# EAGLE design InputBoard (EAGLE 9.4.0)
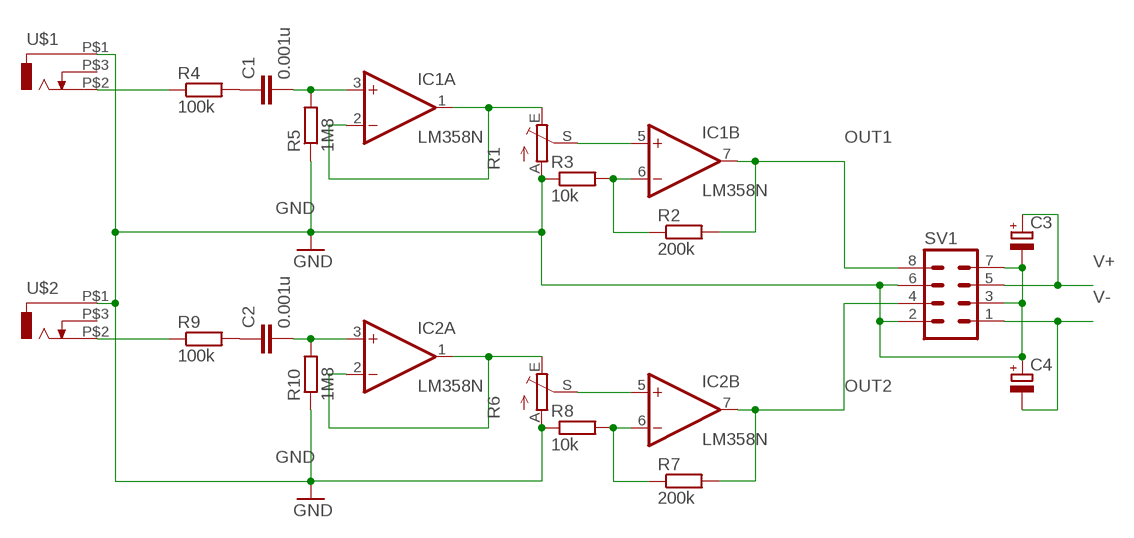
[diagram p0: schematic, sheet 1]

## Parts
C1  0.001u  C-EU050-025X075  [C050-025X075]
C2  0.001u  C-EU050-025X075  [C050-025X075]
C3  CPOL-EUE5-8.5  [E5-8,5]
C4  CPOL-EUE5-8.5  [E5-8,5]
IC1  LM358N  [DIL08]
IC2  LM358N  [DIL08]
R1  TRIM_EU-CIP20C-6MM  [CIP20C-6MM]
R2  200k  R-EU_0207/10  [0207/10]
R3  10k  R-EU_0207/10  [0207/10]
R4  100k  R-EU_0207/10  [0207/10]
R5  1M8  R-EU_0207/10  [0207/10]
R6  TRIM_EU-CIP20C-6MM  [CIP20C-6MM]
R7  200k  R-EU_0207/10  [0207/10]
R8  10k  R-EU_0207/10  [0207/10]
R9  100k  R-EU_0207/10  [0207/10]
R10  1M8  R-EU_0207/10  [0207/10]
SV1  MA04-2  [MA04-2]
U$1  EBS63P  [EBS63P]
U$2  EBS63P  [EBS63P]

## Nets
GND: C3.- C4.+ R1.A R3.1 R5.1 R6.A R8.1 R10.1 SV1.2 SV1.3 SV1.6 SV1.7 U$1.P$1 U$2.P$1
N$1: IC1.1(A:OUT) IC1.2(A:-IN) R1.E
N$2: IC1.5(B:+IN) R1.S
N$3: IC1.6(B:-IN) R2.1 R3.2
N$4: C1.2 IC1.3(A:+IN) R5.2
N$5: C1.1 R4.2
N$6: IC2.1(A:OUT) IC2.2(A:-IN) R6.E
N$7: IC2.5(B:+IN) R6.S
N$8: IC2.6(B:-IN) R7.1 R8.2
N$9: C2.2 IC2.3(A:+IN) R10.2
N$10: C2.1 R9.2
N$11: R9.1 U$2.P$2
N$12: R4.1 U$1.P$2
OUT1: IC1.7(B:OUT) R2.2 SV1.8
OUT2: IC2.7(B:OUT) R7.2 SV1.4
V+: C3.+ SV1.5
V-: C4.- SV1.1
Unconnected: U$1.P$3 U$2.P$3

## Power pins joined to a net without a drawn wire
V+: IC1.8(P:V+) IC2.8(P:V+)
V-: IC1.4(P:V-) IC2.4(P:V-)

## Library data of the parts
C1 C2 = rcl:C-EU: CAPACITOR, European symbol; SPICEPREFIX: C
C3 C4 = rcl:CPOL-EU: POLARIZED CAPACITOR, European symbol; SPICEPREFIX: C
IC1 IC2 = linear:LM358: OP AMP also LM158; LM258; LM2904 Source: http://cache.national.com/ds/LM/LM158.pdf
R1 R6 = pot:TRIM_EU-: POTENTIOMETER
R2-R5 R7-R10 = rcl:R-EU_: RESISTOR, European symbol; SPICEPREFIX: R
SV1 = con-lstb:MA04-2: PIN HEADER; OC_FARNELL: unknown; OC_NEWARK: unknown
U$1 U$2 = EBS63P:EBS63P

## Board
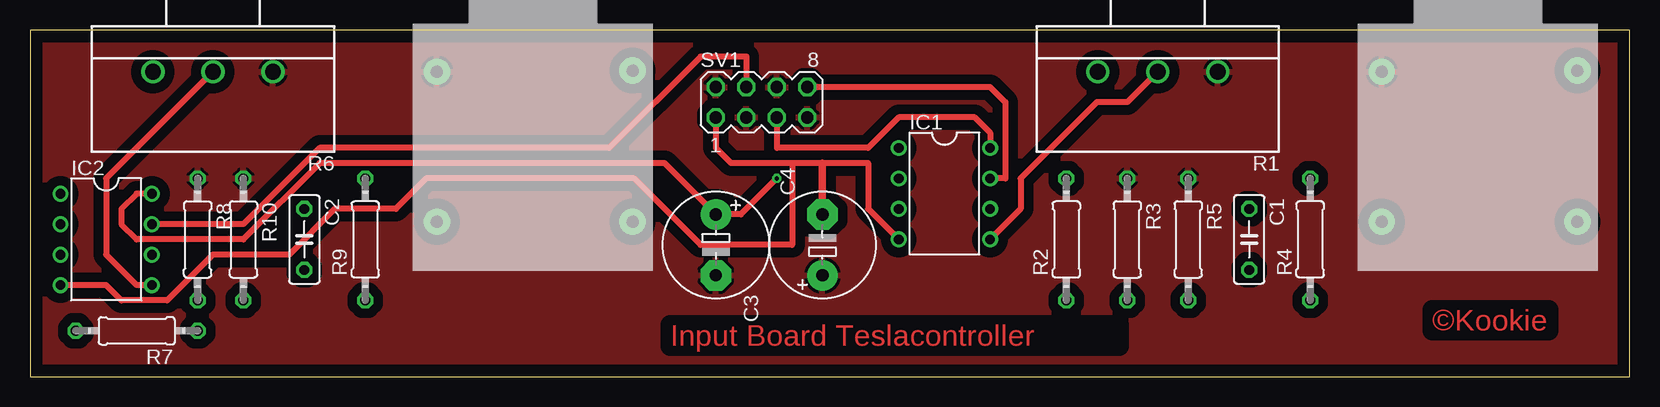
[diagram p1: board, top side]
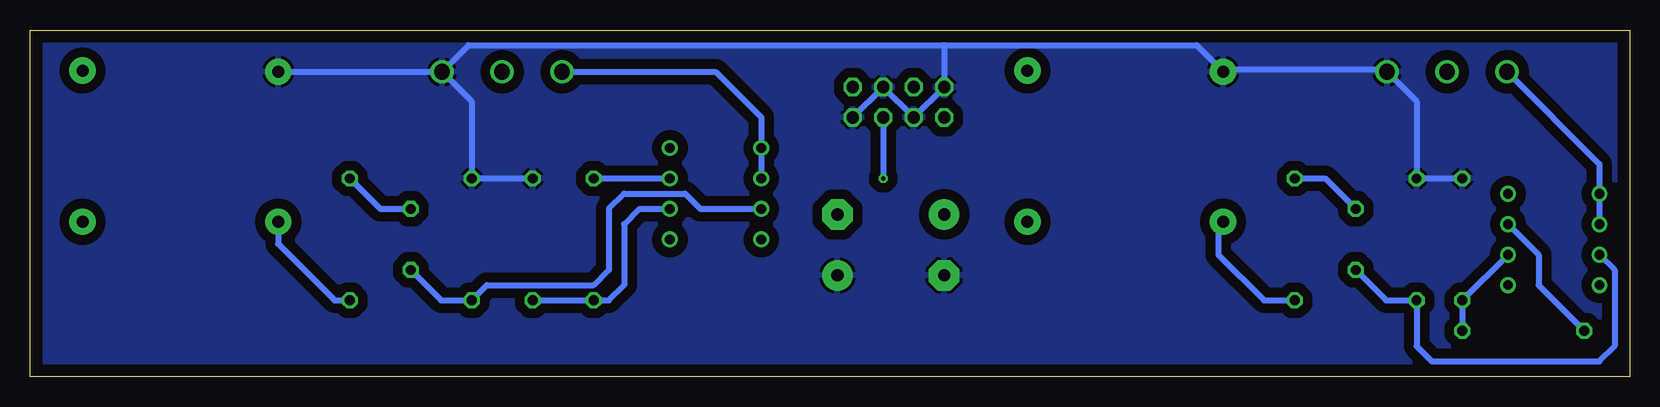
[diagram p2: board, bottom side, seen from below]

Size 133.33 x 28.88 mm. Coordinates in mm from the lower left corner, seen from the top.
Outline: 0,0 133.33,0 133.33,28.88 0,28.88 0,0
Copper layers (1*16): Top 0.035mm / dielectric 1.5mm / Bottom 0.035mm
Design rules "default": minimum track width 6mil, minimum drill 0.35mm, track to track 6mil, track to pad 6mil, pad to pad 6mil, via to via 6mil, smd to smd 6mil, copper to edge 40mil, drill to drill 6mil, minimum pad ring 10mil, minimum via ring 8mil, stop-mask expansion 4mil, vias tented up to drill 0mil, thermal gap 10mil

### Footprints (pad centres in the part's own frame; a part is rotated, then mirrored left to right if it is on the bottom)
C050-025X075 = drill 0.813 octagon: 1 -2.54,0; 2 2.54,0
E5-8,5 = drill 1.016 pad 2.54: + -2.54,0 | drill 1.016 pad 2.54 octagon: - 2.54,0
DIL08 = drill 0.813 pad 1.27: 1 -3.81,-3.81; 2 -1.27,-3.81; 3 1.27,-3.81; 4 3.81,-3.81; 5 3.81,3.81; 6 1.27,3.81; 7 -1.27,3.81; 8 -3.81,3.81
CIP20C-6MM = drill 1.3 pad 1.93: A -5,0; E 5,0; S 0,0
0207/10 = drill 0.813 octagon: 1 -5.08,0; 2 5.08,0
MA04-2 = drill 1.016 octagon: 1 -3.81,-1.27; 2 -3.81,1.27; 3 -1.27,-1.27; 4 -1.27,1.27; 5 1.27,-1.27; 6 1.27,1.27; 7 3.81,-1.27; 8 3.81,1.27
EBS63P = drill 1 pad 2.184: P$1 0,-8; P$2 12.5,-8; P$3 12.5,8.3; P$4 -0.1,8.3

### Placement (x,y rotation side)
C1  101.6,11.43 270 top
C2  22.86,11.43 270 top
C3  57.15,10.97 270 top
C4  66.04,10.97 90 top
IC1  76.2,15.24 270 top
IC2  6.35,11.43 270 top
R1  93.98,25.4 180 top
R2  86.36,11.43 90 top
R3  91.44,11.43 270 top
R4  106.68,11.43 90 top
R5  96.52,11.43 270 top
R6  15.24,25.4 180 top
R7  8.89,3.81 180 top
R8  13.97,11.43 270 top
R9  27.94,11.43 90 top
R10  17.78,11.43 270 top
SV1  60.96,22.86 0 top
U$1  120.65,25.4 270 top
U$2  41.91,25.4 270 top

### Tracks (layer width: path | path; a pad name or v marks a point on that pad's centre or on a via)
GND
  Bottom 0.508: U$1.P$1 R1.A | R1.A 96.77,27.61 57.15,27.61 | 34.1,25.59 36.12,27.61 57.15,27.61 | 34.1,25.59 U$2.P$1 | R3.1 R5.1 96.52,22.94 R1.A | 34.1,25.59 20.43,25.59 R6.A 17.78,22.94 R10.1 R8.1 | SV1.7 SV1.6 SV1.3 SV1.2 57.15,27.61
  pour Top (isolate 0.813): 0,0 133.35,0 133.35,29.21 0,29.21
  pour Bottom (isolate 0.813): 0,29.21 0,0 133.35,0 133.35,29.21
N$1
  Bottom 0.508: IC1.2 IC1.1 72.39,21.59 76.2,25.4 R1.E
N$2
  Top 0.508: IC1.5 82.55,13.97 82.55,16.51 88.9,22.86 91.44,22.86 R1.S
N$3
  Bottom 0.508: R3.2 R2.1 85.09,6.35 83.82,7.62 83.82,12.7 82.55,13.97 IC1.6
N$4
  Bottom 0.508: C1.2 99.06,6.35 R5.2 95.25,7.62 86.36,7.62 85.09,8.89 85.09,13.97 83.82,15.24 78.74,15.24 77.47,13.97 IC1.3
N$5
  Bottom 0.508: R4.2 104.14,13.97 C1.1
N$6
  Bottom 0.508: IC2.2 IC2.1 2.54,17.7 R6.E
N$7
  Top 0.508: IC2.5 8.89,7.62 6.35,10.16 6.35,16.51 R6.S
N$8
  Bottom 0.508: IC2.6 R8.2 R7.1
N$9
  Bottom 0.508: C2.2 20.32,6.35 R10.2 17.78,2.54 16.51,1.27 2.54,1.27 1.27,2.54 1.27,8.89 IC2.3
N$10
  Bottom 0.508: R9.2 25.4,16.51 C2.1
N$11
  Bottom 0.508: U$2.P$2 34.29,12.52 34.29,10.16 30.48,6.35 R9.1
N$12
  Bottom 0.508: R4.1 107.95,6.35 112.65,11.05 U$1.P$2
OUT1
  Top 0.508: SV1.8 80.01,24.13 81.28,22.86 81.28,16.51 IC1.7
  Bottom 0.508: R2.2 IC1.7
OUT2
  Top 0.508: IC2.7 17.78,12.7 24.13,19.05 48.26,19.05 55.88,26.67 59.69,26.67 SV1.4
  Bottom 0.508: R7.2 7.62,7.62 7.62,10.16 IC2.7
V+  (via drill 0.35)
  Top 0.508: SV1.5 62.23,19.05 69.85,19.05 72.39,21.59 78.74,21.59 80.01,20.32 IC1.8 | IC2.8 8.89,15.24 7.62,13.97 7.62,12.7 8.89,11.43 17.78,11.43 24.13,17.78 52.88,17.78 C3.+ 59.23,13.51 v62.23,16.51
  Bottom 0.508: SV1.5 v62.23,16.51
V-
  Top 0.508: IC1.4 69.85,13.97 69.85,17.78 66.04,17.78 63.5,17.78 | SV1.1 57.15,19.05 58.42,17.78 63.5,17.78 | IC2.4 6.35,7.62 7.62,6.35 11.43,6.35 15.24,10.16 21.59,10.16 25.4,13.97 30.48,13.97 33.02,16.51 50.34,16.51 55.88,10.97 63.5,10.97 63.5,17.78
  Top 0.61: 66.04,17.78 C4.-

### Text on the board
Top: ©Kookie | Input Board Teslacontroller